# EAGLE design payloads (EAGLE 8.7.1)
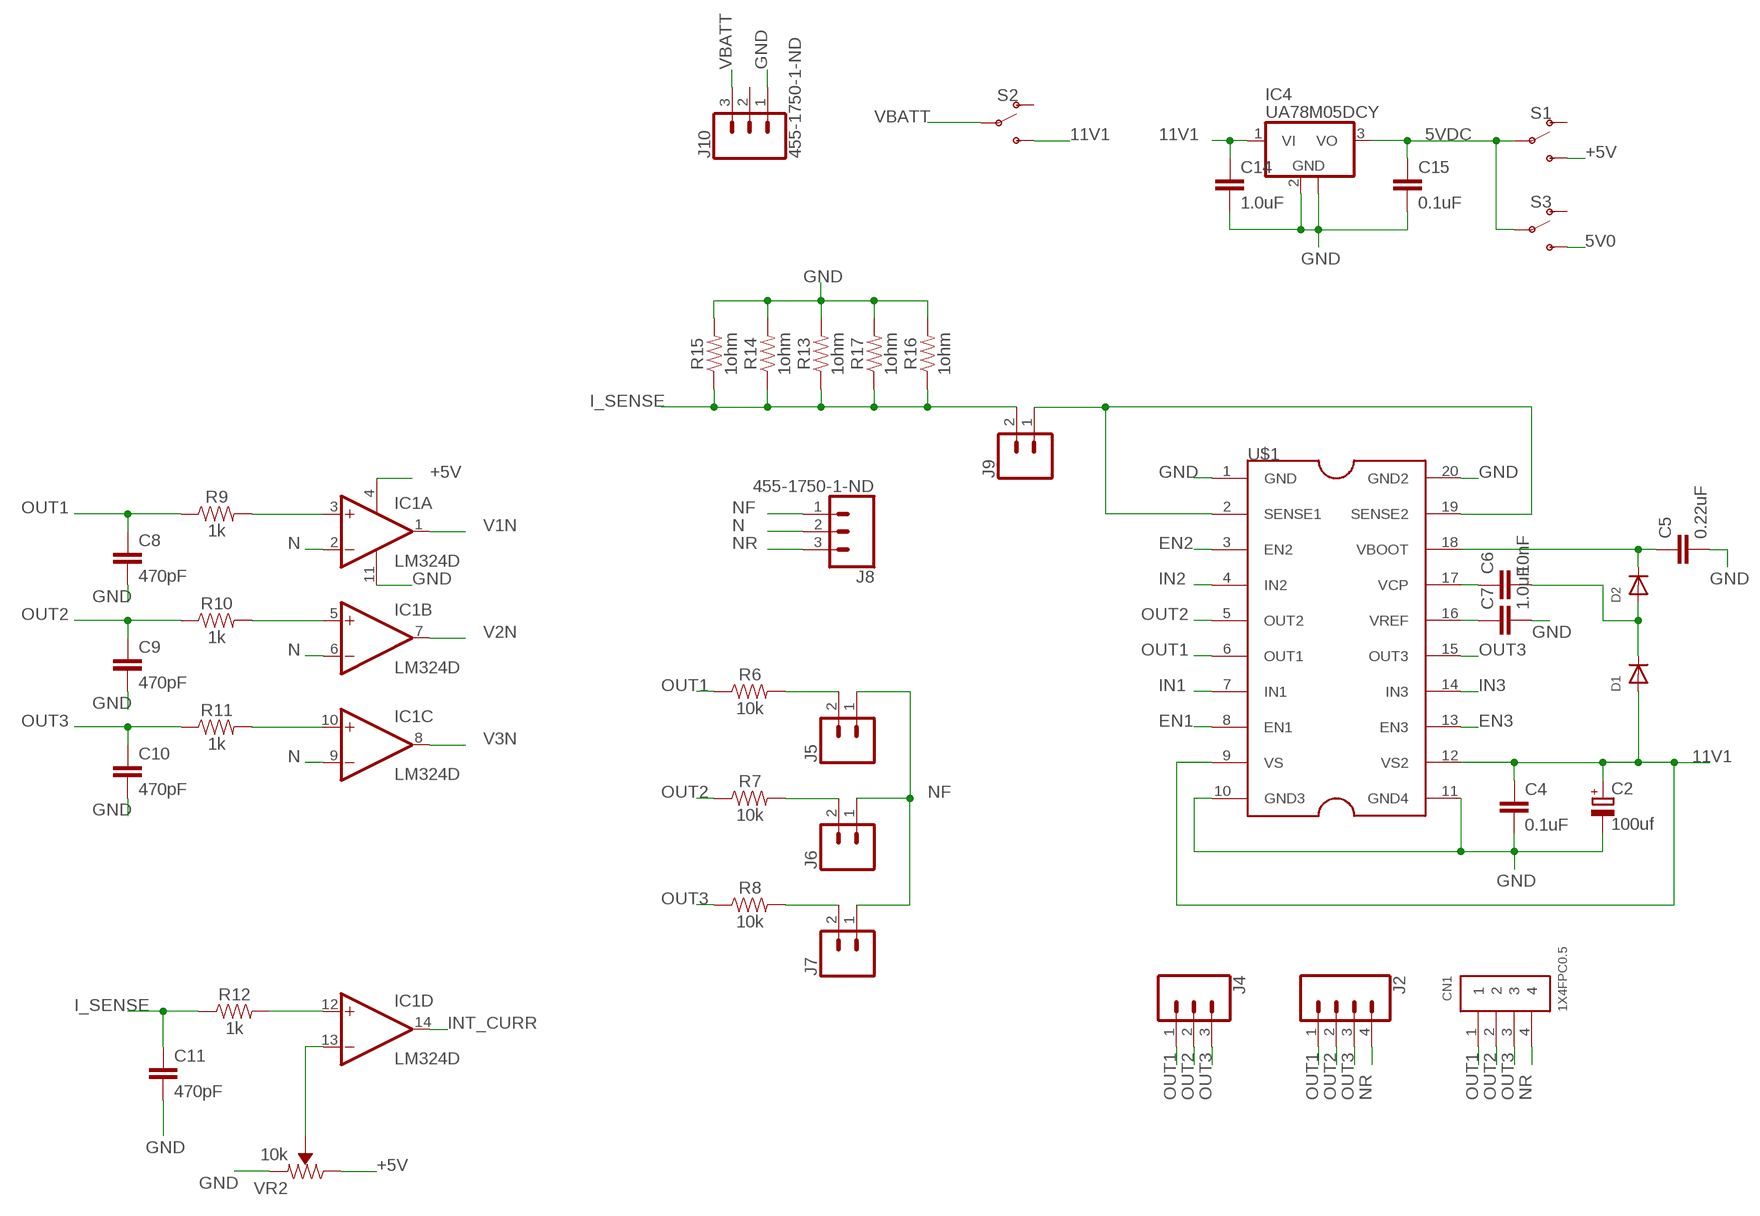
[diagram p0: schematic, sheet 1, part 1 of 2]
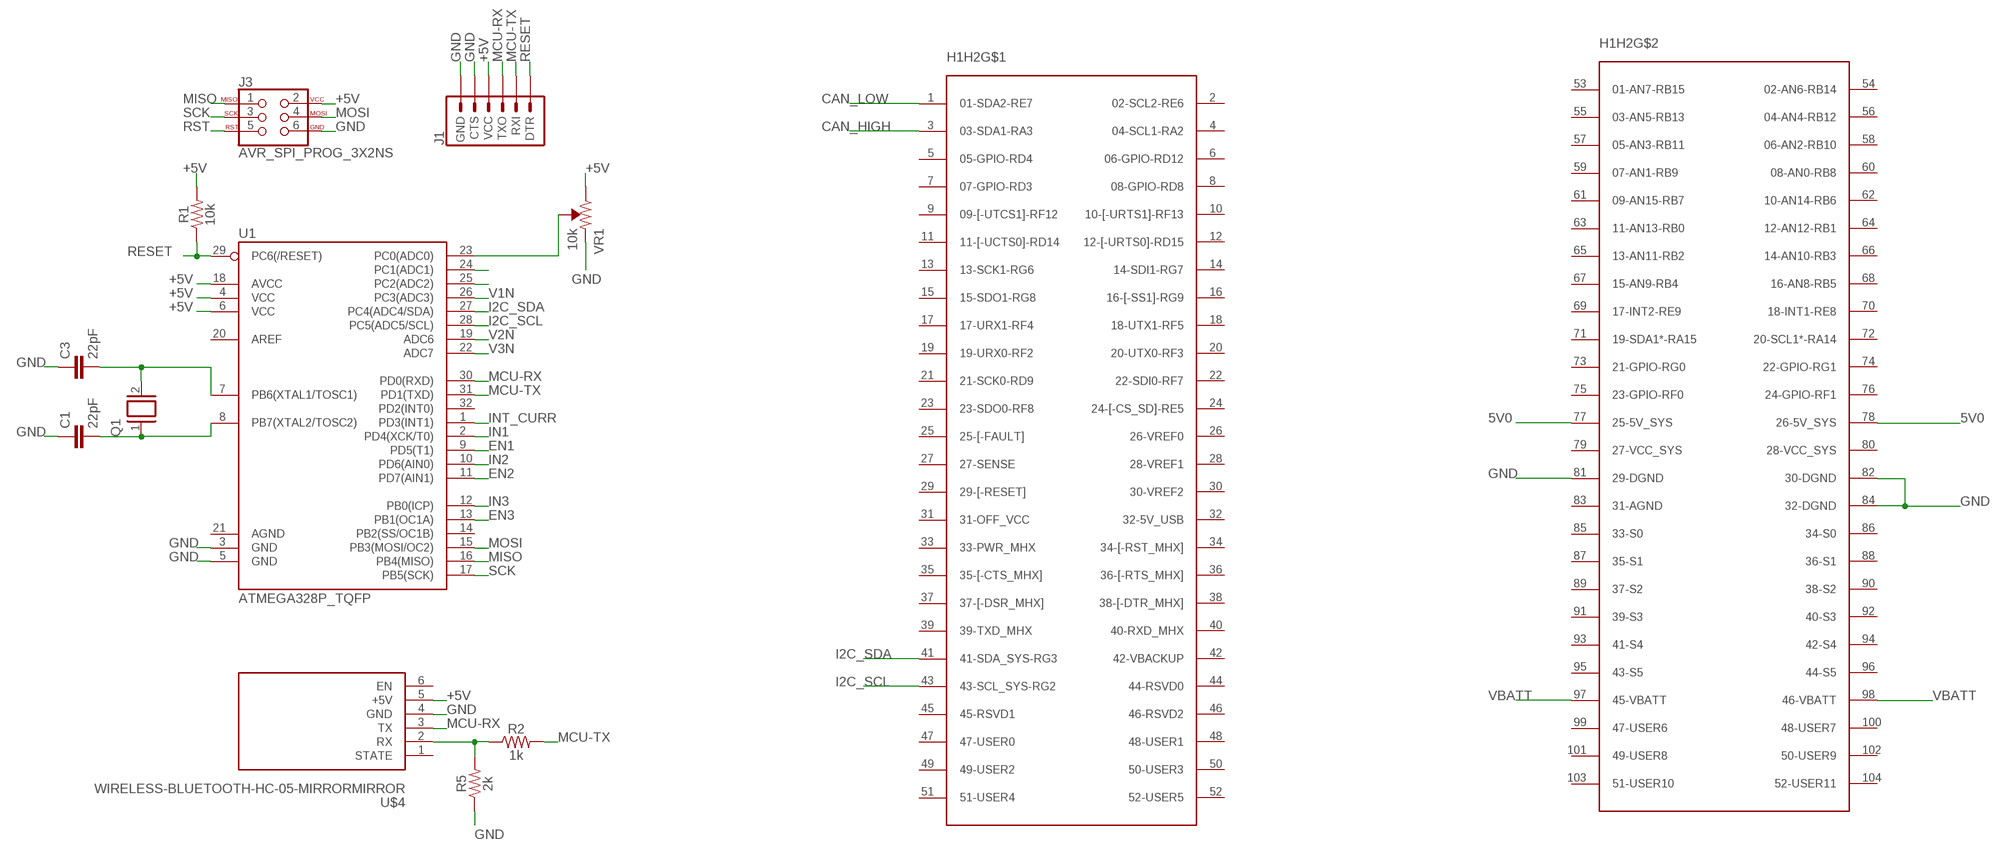
[diagram p1: schematic, sheet 1, part 2 of 2]

## Parts
C1  22pF  2.2UF-1206-50V-10%  [1206]
C2  100uf  CPOL-EUC/6032-28R  [C/6032-28R]
C3  22pF  2.2UF-1206-50V-10%  [1206]
C4  0.1uF  0.1UF-0603-100V-10%  [0603]
C5  0.22uF  0.22UF-0603-25V-10%  [0603]
C6  10nF  10NF-0603-50V-10%  [0603]
C7  1.0uF  1.0UF-0603-16V-10%  [0603]
C8  470pF  470PF-0603-50V-5%  [0603]
C9  470pF  470PF-0603-50V-5%  [0603]
C10  470pF  470PF-0603-50V-5%  [0603]
C11  470pF  470PF-0603-50V-5%  [0603]
C14  1.0uF  1.0UF-1206-50V-10%  [1206]
C15  0.1uF  1.0UF-1206-50V-10%  [1206]
CN1  1X4FPC0.5  [FPC_0.5MM-4]
D1  DIODESOD-123  [SOD-123]
D2  DIODESOD-123  [SOD-123]
H1H2  PC104_CONN  [PC_104]
IC1  LM324D  [SO14]
IC4  UA78M05DCY  [SOT223]
J1  6_PIN_SERIAL_TARGET  [1X06]
J2  CONN_04  [1X04]
J3  AVR_SPI_PROG_3X2NS  [2X3-NS]
J4  CONN_03-SCREW-5MM  [SCREWTERMINAL-5MM-3]
J5  CONN_02  [1X02]
J6  CONN_02  [1X02]
J7  CONN_02  [1X02]
J8  455-1750-1-ND  CONN_03  [1X03]
J9  CONN_02  [1X02]
J10  455-1750-1-ND  CONN_03  [1X03]
Q1  XTAL/S  [QS]
R1  10k  RESISTOR1206  [1206]
R2  1k  1KOHM-HORIZ-1/4W-5%  [AXIAL-0.3]
R5  2k  RESISTORAXIAL-0.3  [AXIAL-0.3]
R6  10k  10KOHM-HORIZ-1/4W-1%  [AXIAL-0.3]
R7  10k  10KOHM-HORIZ-1/4W-1%  [AXIAL-0.3]
R8  10k  10KOHM-HORIZ-1/4W-1%  [AXIAL-0.3]
R9  1k  1KOHM-0603-1/10W-1%  [0603]
R10  1k  1KOHM-0603-1/10W-1%  [0603]
R11  1k  1KOHM-0603-1/10W-1%  [0603]
R12  1k  1KOHM-0603-1/10W-1%  [0603]
R13  1ohm  1KOHM-HORIZ-1/4W-1%  [AXIAL-0.3]
R14  1ohm  1KOHM-HORIZ-1/4W-1%  [AXIAL-0.3]
R15  1ohm  1KOHM-HORIZ-1/4W-1%  [AXIAL-0.3]
R16  1ohm  1KOHM-HORIZ-1/4W-1%  [AXIAL-0.3]
R17  1ohm  1KOHM-HORIZ-1/4W-1%  [AXIAL-0.3]
S1  SWITCH-SPDT-PTH-11.6X4.0MM  [SWITCH_SPDT_PTH_11.6X4.0MM]
S2  SWITCH-SPDT-PTH-11.6X4.0MM  [SWITCH_SPDT_PTH_11.6X4.0MM]
S3  SWITCH-SPDT-PTH-11.6X4.0MM  [SWITCH_SPDT_PTH_11.6X4.0MM]
U1  ATMEGA328P_TQFP  [TQFP32-08]
U$1  L6234PD  [SO20]
U$4  WIRELESS-BLUETOOTH-HC-05-MIRRORMIRROR  [WIRELESS-BLUETOOTH-HC-05-MIRROR]
VR1  10k  TRIMPOT-PTH-10MM-KNOB-1/2W-10%  [TRIMPOT-PTH-3386U]
VR2  10k  TRIMPOT-PTH-10MM-KNOB-1/2W-10%  [TRIMPOT-PTH-3386U]

## Nets
5V0: H1H2.77(25-5V_SYS) H1H2.78(26-5V_SYS) S3.3(S)
5VDC: C15.1 IC4.3(VO) S1.2(P) S3.2(P)
11V1: C2.+ C4.1 C14.1 D1.A IC4.1(VI) S2.3(S) U$1.9(VS) U$1.12(VS2)
+5V: IC1.4(P:V+) J1.4(VCC) J3.2 R1.2 S1.3(S) U1.4(VCC) U1.6(VCC) U1.18(AVCC) U$4.5(+5V) VR1.3(CW) VR2.3(CW)
CAN_HIGH: H1H2.3(03-SDA1-RA3)
CAN_LOW: H1H2.1(01-SDA2-RE7)
EN1: U1.9(PD5(T1)) U$1.8(EN1)
EN2: U1.11(PD7(AIN1)) U$1.3(EN2)
EN3: U1.13(PB1(OC1A)) U$1.13(EN3)
GND: C1.1 C2.- C3.1 C4.2 C5.2 C7.2 C8.2 C9.2 C10.2 C11.2 C14.2 C15.2 H1H2.81(29-DGND) H1H2.82(30-DGND) H1H2.84(32-DGND) IC1.11(P:V-) IC4.2(GND) IC4.4(GND) J1.5(CTS) J1.6(GND) J3.6 J10.1 R5.P$1 R13.P$2 R14.P$2 R15.P$2 R16.P$2 R17.P$2 U1.3(GND) U1.5(GND) U$1.1(GND) U$1.10(GND3) U$1.11(GND4) U$1.20(GND2) U$4.4(GND) VR1.1(CCW) VR2.1(CCW)
I2C_SCL: H1H2.43(43-SCL_SYS-RG2) U1.28(PC5(ADC5/SCL))
I2C_SDA: H1H2.41(41-SDA_SYS-RG3) U1.27(PC4(ADC4/SDA))
I_SENSE: C11.1 J9.2 R12.1 R13.P$1 R14.P$1 R15.P$1 R16.P$1 R17.P$1
IN1: U1.2(PD4(XCK/T0)) U$1.7(IN1)
IN2: U1.10(PD6(AIN0)) U$1.4(IN2)
IN3: U1.12(PB0(ICP)) U$1.14(IN3)
INT_CURR: IC1.14(D:OUT) U1.1(PD3(INT1))
MCU-RX: J1.3(TXO) U1.30(PD0(RXD)) U$4.3(TX)
MCU-TX: J1.2(RXI) R2.P$2 U1.31(PD1(TXD))
MISO: J3.1 U1.16(PB4(MISO))
MOSI: J3.4 U1.15(PB3(MOSI/OC2))
N: IC1.2(A:-IN) IC1.6(B:-IN) IC1.9(C:-IN) J8.2
N$1: C3.2 Q1.2 U1.7(PB6(XTAL1/TOSC1))
N$2: C1.2 Q1.1 U1.8(PB7(XTAL2/TOSC2))
N$3: R2.P$1 R5.P$2 U$4.2(RX)
N$5: C6.1 U$1.17(VCP)
N$6: C6.2 D1.C D2.A
N$7: C5.1 D2.C U$1.18(VBOOT)
N$8: IC1.13(D:-IN) VR2.2(WIPER)
N$9: U1.23(PC0(ADC0)) VR1.2(WIPER)
N$10: C7.1 U$1.16(VREF)
N$11: IC1.3(A:+IN) R9.2
N$12: J5.2 R6.P$2
N$13: J6.2 R7.P$2
N$14: J7.2 R8.P$2
N$15: IC1.5(B:+IN) R10.2
N$16: IC1.10(C:+IN) R11.2
N$17: IC1.12(D:+IN) R12.2
N$18: U1.25(PC2(ADC2))
N$19: U1.24(PC1(ADC1))
N$21: J9.1 U$1.2(SENSE1) U$1.19(SENSE2)
NF: J5.1 J6.1 J7.1 J8.1
NR: CN1.4 J2.4 J8.3
OUT1: C8.1 CN1.1 J2.1 J4.1 R6.P$1 R9.1 U$1.6(OUT1)
OUT2: C9.1 CN1.2 J2.2 J4.2 R7.P$1 R10.1 U$1.5(OUT2)
OUT3: C10.1 CN1.3 J2.3 J4.3 R8.P$1 R11.1 U$1.15(OUT3)
RESET: J1.1(DTR) R1.1 U1.29(PC6(/RESET))
RST: J3.5
SCK: J3.3 U1.17(PB5(SCK))
V1N: IC1.1(A:OUT) U1.26(PC3(ADC3))
V2N: IC1.7(B:OUT) U1.19(ADC6)
V3N: IC1.8(C:OUT) U1.22(ADC7)
VBATT: H1H2.97(45-VBATT) H1H2.98(46-VBATT) J10.3 S2.2(P)
Unconnected: H1H2.2(02-SCL2-RE6) H1H2.4(04-SCL1-RA2) H1H2.5(05-GPIO-RD4) H1H2.6(06-GPIO-RD12) H1H2.7(07-GPIO-RD3) H1H2.8(08-GPIO-RD8) H1H2.9(09-[-UTCS1]-RF12) H1H2.10(10-[-URTS1]-RF13) H1H2.11(11-[-UCTS0]-RD14) H1H2.12(12-[-URTS0]-RD15) H1H2.13(13-SCK1-RG6) H1H2.14(14-SDI1-RG7) H1H2.15(15-SDO1-RG8) H1H2.16(16-[-SS1]-RG9) H1H2.17(17-URX1-RF4) H1H2.18(18-UTX1-RF5) H1H2.19(19-URX0-RF2) H1H2.20(20-UTX0-RF3) H1H2.21(21-SCK0-RD9) H1H2.22(22-SDI0-RF7) H1H2.23(23-SDO0-RF8) H1H2.24(24-[-CS_SD]-RE5) H1H2.25(25-[-FAULT]) H1H2.26(26-VREF0) H1H2.27(27-SENSE) H1H2.28(28-VREF1) H1H2.29(29-[-RESET]) H1H2.30(30-VREF2) H1H2.31(31-OFF_VCC) H1H2.32(32-5V_USB) H1H2.33(33-PWR_MHX) H1H2.34(34-[-RST_MHX]) H1H2.35(35-[-CTS_MHX]) H1H2.36(36-[-RTS_MHX]) H1H2.37(37-[-DSR_MHX]) H1H2.38(38-[-DTR_MHX]) H1H2.39(39-TXD_MHX) H1H2.40(40-RXD_MHX) H1H2.42(42-VBACKUP) H1H2.44(44-RSVD0) H1H2.45(45-RSVD1) H1H2.46(46-RSVD2) H1H2.47(47-USER0) H1H2.48(48-USER1) H1H2.49(49-USER2) H1H2.50(50-USER3) H1H2.51(51-USER4) H1H2.52(52-USER5) H1H2.53(01-AN7-RB15) H1H2.54(02-AN6-RB14) H1H2.55(03-AN5-RB13) H1H2.56(04-AN4-RB12) H1H2.57(05-AN3-RB11) H1H2.58(06-AN2-RB10) H1H2.59(07-AN1-RB9) H1H2.60(08-AN0-RB8) H1H2.61(09-AN15-RB7) H1H2.62(10-AN14-RB6) H1H2.63(11-AN13-RB0) H1H2.64(12-AN12-RB1) H1H2.65(13-AN11-RB2) H1H2.66(14-AN10-RB3) H1H2.67(15-AN9-RB4) H1H2.68(16-AN8-RB5) H1H2.69(17-INT2-RE9) H1H2.70(18-INT1-RE8) H1H2.71(19-SDA1*-RA15) H1H2.72(20-SCL1*-RA14) H1H2.73(21-GPIO-RG0) H1H2.74(22-GPIO-RG1) H1H2.75(23-GPIO-RF0) H1H2.76(24-GPIO-RF1) H1H2.79(27-VCC_SYS) H1H2.80(28-VCC_SYS) H1H2.83(31-AGND) H1H2.85(33-S0) H1H2.86(34-S0) H1H2.87(35-S1) H1H2.88(36-S1) H1H2.89(37-S2) H1H2.90(38-S2) H1H2.91(39-S3) H1H2.92(40-S3) H1H2.93(41-S4) H1H2.94(42-S4) H1H2.95(43-S5) H1H2.96(44-S5) H1H2.99(47-USER6) H1H2.100(48-USER7) H1H2.101(49-USER8) H1H2.102(50-USER9) H1H2.103(51-USER10) H1H2.104(52-USER11) J10.2 S1.1(O) S2.1(O) S3.1(O) U1.14(PB2(SS/OC1B)) U1.20(AREF) U1.21(AGND) U1.32(PD2(INT0)) U$4.1(STATE) U$4.6(EN)

## Library data of the parts
C1 C3 = SparkFun-Capacitors:2.2UF: 2.2µF ceramic capacitors A capacitor is a passive two-terminal electrical component used to store electrical energy temporarily in an electric field.; PROD_ID: CAP-10009; VALUE: 2.2uF
C2 = rcl:CPOL-EU: POLARIZED CAPACITOR, European symbol; SPICEPREFIX: C
C4 = SparkFun-Capacitors:0.1UF: 0.1µF ceramic capacitors A capacitor is a passive two-terminal electrical component used to store electrical energy temporarily in an electric field.; PROD_ID: CAP-08390
C5 = SparkFun-Capacitors:0.22UF: 0.22µF ceramic capacitors A capacitor is a passive two-terminal electrical component used to store electrical energy temporarily in an electric field.; PROD_ID: CAP-07822
C6 = SparkFun-Capacitors:10NF: 0.01uF/10nF/10,000pF ceramic capacitors A capacitor is a passive two-terminal electrical component used to store electrical energy temporarily in an electric field. CAP-09321; PROD_ID: CAP-00867
C7 = SparkFun-Capacitors:1.0UF: 1µF ceramic capacitors A capacitor is a passive two-terminal electrical component used to store electrical energy temporarily in an electric field.; PROD_ID: CAP-00868
C8-C11 = SparkFun-Capacitors:470PF: 470pF ceramic capacitors A capacitor is a passive two-terminal electrical component used to store electrical energy temporarily in an electric field.; PROD_ID: CAP-07884
C14 = SparkFun-Capacitors:1.0UF: 1µF ceramic capacitors A capacitor is a passive two-terminal electrical component used to store electrical energy temporarily in an electric field.; PROD_ID: CAP-09822
C15 = SparkFun-Capacitors:1.0UF: 1µF ceramic capacitors A capacitor is a passive two-terminal electrical component used to store electrical energy temporarily in an electric field.; PROD_ID: CAP-09822; VALUE: 1.0uF
CN1 = adafruit:1X4: 4-pin connector
D1 D2 = adafruit:DIODE: Diode SMADIODE - SMA Surface Mount Package 20V 1A Schottky Diode Digikey: 641-1014-6-ND DO-1N4148 - Through Hole Small Current Diode SOD-123 20V 1 A (.5mV Vf) Schottky Diode - Digikey: MBRX120TPMSCT-ND SOD-323 10V 570mA (.38mV Vf, 3ns) Schottky Diode - Digikey: ZLLS410CT-ND SOD-523 30V 30mA Schottky Diode (RB751S-40TE61) - Digikey: RB751S-40TE61CT-ND SOT23-R/W - SOT23 Package (R = Solder Paste/Reflow Ovens, W = Hand-Soldering) BAT54Film 40V 300mA - Digikey: 497-7162-1-ND
H1H2 = SUCHAI:PC104_CONN
IC1 = linear:LM324: OP AMP
IC4 = linear:UA78M*: POSITIVE-VOLTAGE REGULATORS Source: http://focus.ti.com/lit/ds/symlink/ua78m33.pdf
J1 = SparkFun-Connectors:6_PIN_SERIAL_TARGET: 6-pin header connection for use with the "FTDI BASIC" pinout - TARGET SIDE. Also known as "Arduino Serial Program Header". It is used to mate with our FTDI Basic serial programmers using the Arduino IDE. Note, this device has "TARGET" in the name. It is intended to be used on a design that contains a target micro-controller that you wish to program. The "sister" device, named "CABLE" is inteneded to be used on a design that usually lives on the end of your USB cable and prvides the converter chip (FTDI232 or FTDI231x) to commnicate serial RX/TX. You can populate with some of these: Break Away Headers - Straight <https://www.sparkfun.com/products/116> (PRT-00116) For reference (or to suit your programming needs) check out these designs: SparkFun FTDI Basic Breakout - 5V <https://www.sparkfun.com/products/9716> (DEV-09716) SparkFun FTDI Basic Breakout - 3.3V <https://www.sparkfun.com/products/9873> (DEV-09873) SparkFun FTDI SmartBasic <https://www.sparkfun.com/products/12935> (DEV-12935) SparkFun Beefy 3 - FTDI Basic Breakout <https://www.sparkfun.com/products/13746> (DEV-13746)
J2 = SparkFun-Connectors:CONN_04: Multi connection point. Often used as Generic Header-pin footprint for 0.1 inch spaced/style header connections On any of the 0.1 inch spaced packages, you can populate with these: Break Away Headers - Straight <https://www.sparkfun.com/products/116> (PRT-00116) Break Away Male Headers - Right Angle <https://www.sparkfun.com/products/553> (PRT-00553) Female Headers <https://www.sparkfun.com/products/115> (PRT-00115) Break Away Headers - Machine Pin <https://www.sparkfun.com/products/117> (PRT-00117) Break Away Female Headers - Swiss Machine Pin <https://www.sparkfun.com/products/743> (PRT-00743) For SCREWTERMINALS and SPRING TERMINALS visit here: Screw Terimnals on SparkFun.com <https://www.sparkfun.com/search/results?term=Screw+Terminals> (5mm/3.5mm/2.54mm spacing) This device is also useful as a general connection point to wire up your design to another part of your project. Our various solder wires solder well into these plated through hole pads. Hook-Up Wire - Assortment (Stranded, 22 AWG) <https://www.sparkfun.com/products/11375> (PRT-11375) Hook-Up Wire - Assortment (Solid Core, 22 AWG) <https://www.sparkfun.com/products/11367> (PRT-11367) View the entire wire category on our website here <https://www.sparkfun.com/categories/141> Special notes: Molex polarized connector foot print use with SKU : PRT-08231 with associated crimp pins and housings. 1MM SMD Version SKU: PRT-10208; PROD_ID: CONN-09696
J3 = SparkFun-Connectors:AVR_SPI_PROG_3X2: AVR ISP 6 Pin This is the reduced ISP connector for AVR programming. Common on Arduino. This footprint will take up less PCB space and can be used with a 10-pin to 6-pin adapter such as SKU: BOB-08508 **Special note about "TEST_POINT" package. The stop mask is on the top side, so if you want your programming test points to be on the bottom of your board, make sure to place this package on the bottom side of the board. This also ensure that the orientation to program from the bottom side will be correct. SparkFun Products: SparkFun ISP Pogo Adapter <https://www.sparkfun.com/products/11591> - NS Tiny AVR Programmer <https://www.sparkfun.com/products/11801> -PTH
J4 = SparkFun-Connectors:CONN_03: Multi connection point. Often used as Generic Header-pin footprint for 0.1 inch spaced/style header connections On any of the 0.1 inch spaced packages, you can populate with these: Break Away Headers - Straight <https://www.sparkfun.com/products/116> (PRT-00116) Break Away Male Headers - Right Angle <https://www.sparkfun.com/products/553> (PRT-00553) Female Headers <https://www.sparkfun.com/products/115> (PRT-00115) Break Away Headers - Machine Pin <https://www.sparkfun.com/products/117> (PRT-00117) Break Away Female Headers - Swiss Machine Pin <https://www.sparkfun.com/products/743> (PRT-00743) Stackable Header - 3 Pin (Female, 0.1") <https://www.sparkfun.com/products/13875> (PRT-13875) For SCREWTERMINALS and SPRING TERMINALS visit here: Screw Terimnals on SparkFun.com <https://www.sparkfun.com/search/results?term=Screw+Terminals> (5mm/3.5mm/2.54mm spacing) This device is also useful as a general connection point to wire up your design to another part of your project. Our various solder wires solder well into these plated through hole pads. Hook-Up Wire - Assortment (Stranded, 22 AWG) <https://www.sparkfun.com/products/11375> (PRT-11375) Hook-Up Wire - Assortment (Solid Core, 22 AWG) <https://www.sparkfun.com/products/11367> (PRT-11367) View the entire wire category on our website here <https://www.sparkfun.com/categories/141> Special notes: Molex polarized connector foot print use with SKU : PRT-08232 with associated crimp pins and housings.; PROD_ID: CONN-10134; SF_SKU: PRT-08433
J5-J7 J9 = SparkFun-Connectors:CONN_02: Multi connection point. Often used as Generic Header-pin footprint for 0.1 inch spaced/style header connections On any of the 0.1 inch spaced packages, you can populate with these: Break Away Headers - Straight <https://www.sparkfun.com/products/116> (PRT-00116) Break Away Male Headers - Right Angle <https://www.sparkfun.com/products/553> (PRT-00553) Female Headers <https://www.sparkfun.com/products/115> (PRT-00115) Break Away Headers - Machine Pin <https://www.sparkfun.com/products/117> (PRT-00117) Break Away Female Headers - Swiss Machine Pin <https://www.sparkfun.com/products/743> (PRT-00743) For SCREWTERMINALS and SPRING TERMINALS visit here: Screw Terimnals on SparkFun.com <https://www.sparkfun.com/search/results?term=Screw+Terminals> (5mm/3.5mm/2.54mm spacing) This device is also useful as a general connection point to wire up your design to another part of your project. Our various solder wires solder well into these plated through hole pads. Hook-Up Wire - Assortment (Stranded, 22 AWG) <https://www.sparkfun.com/products/11375> (PRT-11375) Hook-Up Wire - Assortment (Solid Core, 22 AWG) <https://www.sparkfun.com/products/11367> (PRT-11367) View the entire wire category on our website here <https://www.sparkfun.com/categories/141> Special notes: Molex polarized connector foot print use with: PRT-08233 with associated crimp pins and housings. 2.54_SCREWTERM for use with PRT-10571. 3.5mm Screw Terminal footprints for PRT-08084 5mm Screw Terminal footprints for use with PRT-08432
J8 J10 = SparkFun-Connectors:CONN_03: Multi connection point. Often used as Generic Header-pin footprint for 0.1 inch spaced/style header connections On any of the 0.1 inch spaced packages, you can populate with these: Break Away Headers - Straight <https://www.sparkfun.com/products/116> (PRT-00116) Break Away Male Headers - Right Angle <https://www.sparkfun.com/products/553> (PRT-00553) Female Headers <https://www.sparkfun.com/products/115> (PRT-00115) Break Away Headers - Machine Pin <https://www.sparkfun.com/products/117> (PRT-00117) Break Away Female Headers - Swiss Machine Pin <https://www.sparkfun.com/products/743> (PRT-00743) Stackable Header - 3 Pin (Female, 0.1") <https://www.sparkfun.com/products/13875> (PRT-13875) For SCREWTERMINALS and SPRING TERMINALS visit here: Screw Terimnals on SparkFun.com <https://www.sparkfun.com/search/results?term=Screw+Terminals> (5mm/3.5mm/2.54mm spacing) This device is also useful as a general connection point to wire up your design to another part of your project. Our various solder wires solder well into these plated through hole pads. Hook-Up Wire - Assortment (Stranded, 22 AWG) <https://www.sparkfun.com/products/11375> (PRT-11375) Hook-Up Wire - Assortment (Solid Core, 22 AWG) <https://www.sparkfun.com/products/11367> (PRT-11367) View the entire wire category on our website here <https://www.sparkfun.com/categories/141> Special notes: Molex polarized connector foot print use with SKU : PRT-08232 with associated crimp pins and housings.; PROD_ID: XXX-00000
Q1 = special:XTAL/S: CRYSTAL
R1 = SparkFun-Resistors:RESISTOR: Generic Resistor Package
R2 = resistors-longpads:1KOHM: 1kΩ resistor A resistor is a passive two-terminal electrical component that implements electrical resistance as a circuit element. Resistors act to reduce current flow, and, at the same time, act to lower voltage levels within circuits. - Wikipedia; PROD_ID: RES-08380
R5 = resistors-longpads:RESISTOR: Generic Resistor Package
R6-R8 = SparkFun-Resistors:10KOHM: 10kΩ resistor A resistor is a passive two-terminal electrical component that implements electrical resistance as a circuit element. Resistors act to reduce current flow, and, at the same time, act to lower voltage levels within circuits. - Wikipedia; PROD_ID: RES-12183
R9-R12 = SparkFun-Resistors:1KOHM: 1kΩ resistor A resistor is a passive two-terminal electrical component that implements electrical resistance as a circuit element. Resistors act to reduce current flow, and, at the same time, act to lower voltage levels within circuits. - Wikipedia; PROD_ID: RES-07856
R13-R17 = SparkFun-Resistors:1KOHM: 1kΩ resistor A resistor is a passive two-terminal electrical component that implements electrical resistance as a circuit element. Resistors act to reduce current flow, and, at the same time, act to lower voltage levels within circuits. - Wikipedia; PROD_ID: RES-12182; VALUE: 1k
S1-S3 = SparkFun-Switches:SWITCH-SPDT: Single Pole, Double Throw (SPDT) Switch Single-pole, double-throw (SPDT) switch. Variant Overview SMD-AYZ0202 Surface Mount DPDT Switch <https://www.sparkfun.com/products/597> (COM-00597) Used on e.g. LilyPad Arduino USB - ATmega32U4 Board <https://www.sparkfun.com/products/12049> PTH-11.6X4.0MM SPDT Mini Power Switch <https://www.sparkfun.com/products/102> (COM-00102) Used on e.g. SparkFun Simon Says - Through-Hole Soldering Kit <https://www.sparkfun.com/products/10547> (KIT-10547) PTH-11.6X4.0MM-KIT KIT version of SPDT Mini Power Switch - Simplifies soldering by removing tStop of switch pins - only one side can be soldered. PTH-11.6X4.0MM-LOCK LOCK version of SPDT Mini Power Switch - Offset pins hold switch in place for easier soldering. SMD-RIGHT-ANGLE Surface Mount Right Angle Switch <https://www.sparkfun.com/products/10860> (COM-10860) Used on e.g. SparkFun ESP8266 Thing <https://www.sparkfun.com/products/13231>; PROD_ID: SWCH-08261; SF_SKU: COM-00102
U1 = SparkFun-IC-Microcontroller:ATMEGA328P_TQFP: Popular 328P in QFP Storefront component: ATmega328 - TQFP <https://www.sparkfun.com/products/13448> (COM-13448) Datasheet <http://www.sparkfun.com/datasheets/Components/SMD/ATMega328.pdf> SparkFun Products SparkFun RedBoard - Programmed with Arduino <https://www.sparkfun.com/products/12757> (DEV-12757) Arduino Pro Mini 328 - 5V/16MHz <https://www.sparkfun.com/products/11113> (DEV-11113) Arduino Pro Mini 328 - 3.3V/8MHz <https://www.sparkfun.com/products/11114> (DEV-11114) SparkFun OpenLog <https://www.sparkfun.com/products/13712> (DEV-13712) SparkFun MicroView - OLED Arduino Module <https://www.sparkfun.com/products/12923> (DEV-12923) SparkFun Digital Sandbox <https://www.sparkfun.com/products/12651> (DEV-12651) SparkFun PicoBoard <https://www.sparkfun.com/products/11888> (WIG-11888) Arduino Fio <https://www.sparkfun.com/products/10116> (DEV-10116) LilyPad Arduino 328 Main Board <https://www.sparkfun.com/products/13342> (DEV-13342) SparkFun RedStick <https://www.sparkfun.com/products/13741> (DEV-13741) LilyPad MP3 <https://www.sparkfun.com/products/11013> (DEV-11013) LilyPad Arduino SimpleSnap <https://www.sparkfun.com/products/10941> (DEV-10941) SparkFun Stepoko <https://www.sparkfun.com/products/13899> (ROB-13899) SparkFun Geiger Counter <https://www.sparkfun.com/products/11345> (SEN-11345) SparkFun EL Sequencer <https://www.sparkfun.com/products/12781> (COM-12781) Arduino Pro 328 - 5V/16MHz <https://www.sparkfun.com/products/10915> (DEV-10915) CryptoCape <https://www.sparkfun.com/products/12773> (DEV-12773) SparkFun IR Thermometer Evaluation Board - MLX90614 <https://www.sparkfun.com/products/10740> (SEN-10740) SparkFun RedBot Mainboard <https://www.sparkfun.com/products/12097> (ROB-12097) Arduino Pro 328 - 3.3V/8MHz <https://www.sparkfun.com/products/10914> (DEV-10914) SparkFun Block for Intel® Edison - Arduino <https://www.sparkfun.com/products/13036> (DEV-13036) SparkFun Simon Says - Surface Mount Soldering Kit <https://www.sparkfun.com/products/10935> (KIT-10935) SparkFun 7-Segment Serial Display - Red <https://www.sparkfun.com/products/11441> (COM-11441) SparkFun 7-Segment Serial Display - White <https://www.sparkfun.com/products/11629> (COM-11629) SparkFun 7-Segment Serial Display - Yellow <https://www.sparkfun.com/products/11443> (COM-11443) SparkFun 7-Segment Serial Display - Kelly Green <https://www.sparkfun.com/products/11440> (COM-11440) SparkFun 7-Segment Serial Display - Blue <https://www.sparkfun.com/products/11442> (COM-11442) SparkFun OpenSegment Serial Display - 20mm (Blue) <https://www.sparkfun.com/products/11647> (COM-11647) SparkFun OpenSegment Serial Display - 20mm (Green) <https://www.sparkfun.com/products/11646> (COM-11646) SparkFun OpenSegment Serial Display - 20mm (White) <https://www.sparkfun.com/products/11648> (COM-11648) SparkFun OpenSegment Serial Display - 20mm (Red) <https://www.sparkfun.com/products/11644> (COM-11644) SparkFun OpenSegment Serial Display - 20mm (Yellow) <https://www.sparkfun.com/products/11645> (COM-11645) SparkFun OpenSegment Shield <https://www.sparkfun.com/products/13190> (DEV-13190); PROD_ID: IC-09069
U$1 = BLDC_DRIVER:L6234PD: The L6234 is a triple half bridge to drive a brushless DC motor.
U$4 = diy-modules:WIRELESS-BLUETOOTH-HC-05-MIRROR: Bluetooth Transceiver Module based on HC-05 board Tutorial is available here: https://arduino-info.wikispaces.com/BlueTooth-HC05-HC06-Modules-How-To Click here to find device on ebay.com <http://www.ebay.com/sch/hc-05+module+rs232>
VR1 VR2 = SparkFun-Resistors:TRIMPOT: Trimming Potentiometer (Trimpot) Three-terminal potentiometers, with an adjustable wiper and two adjustable resistors. A pot can be used to create a configurable voltage divider, or as a variable resistor. "Trimpots" are a subset of potentiometers, usually intended for "set-and-forget" applications. They're often more delicate than standard potentiometers - rated for fewer turns. Variants PTH-KNOB - PTH Trimpot w/ finger-adjustable knob Trimpot 10K with Knob <https://www.sparkfun.com/products/9806> (COM-09806) Datasheet <http://www.sparkfun.com/datasheets/Components/General/TSR-3386.pdf> SMD-3MM-CLOSED-FRAME - SMD 3mm Square Closed-Frame Trimpot Used on e.g. EasyDriver - Stepper Motor Driver <https://www.sparkfun.com/products/12779> Datasheet <http://www.bitechnologies.com/pdfs/22.pdf> (22AR10KTR) SMD-5MM - SMD 5mm Square Closed-Frame Trimpot Used on e.g. IOIO-OTG - V2.2 <https://www.sparkfun.com/products/13613> Datasheet <http://www.vishay.com/docs/51008/ts53.pdf> (TS53YL502MR10) SMD-3MM-1/10W-25% - 3mm Square Open-Frame Trimpot Used on e.g. SparkFun Shapeoko <https://www.sparkfun.com/products/13899> Datasheet <http://www.bourns.com/docs/Product-Datasheets/TC33.pdf> (TC33X-2-103E); PROD_ID: RES-09730; SF_SKU: COM-09806

## Board
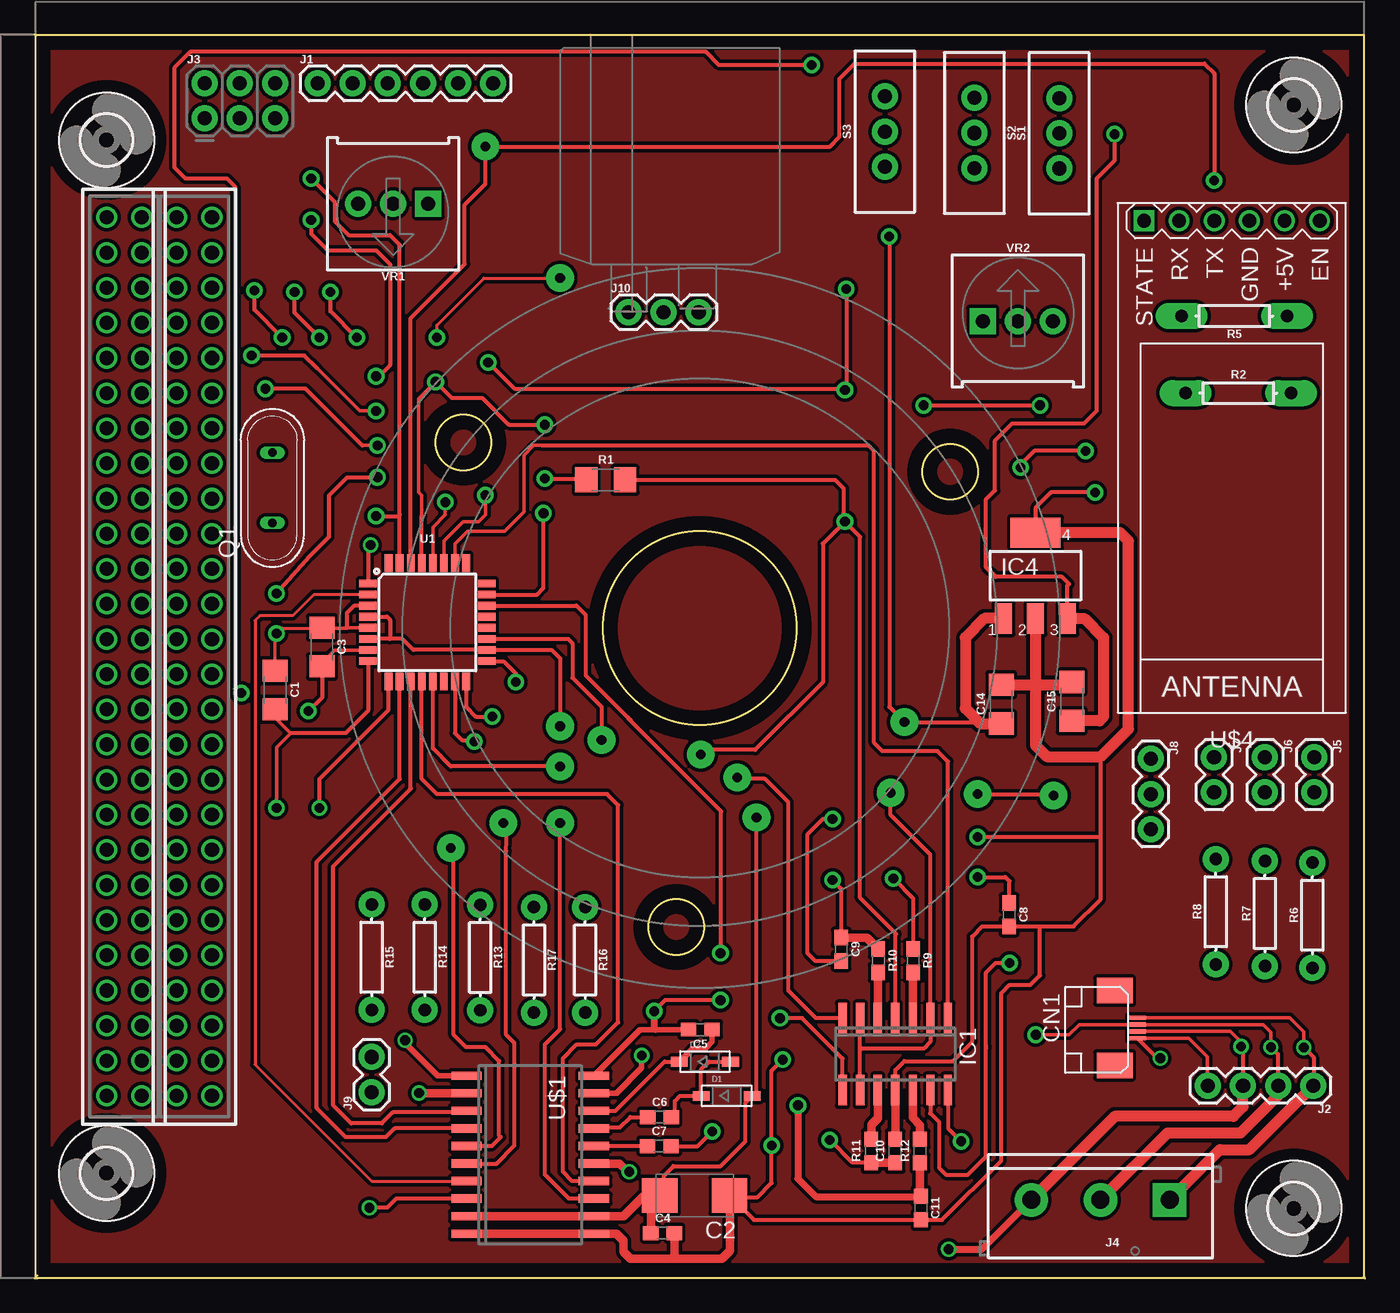
[diagram p2: board, top side]
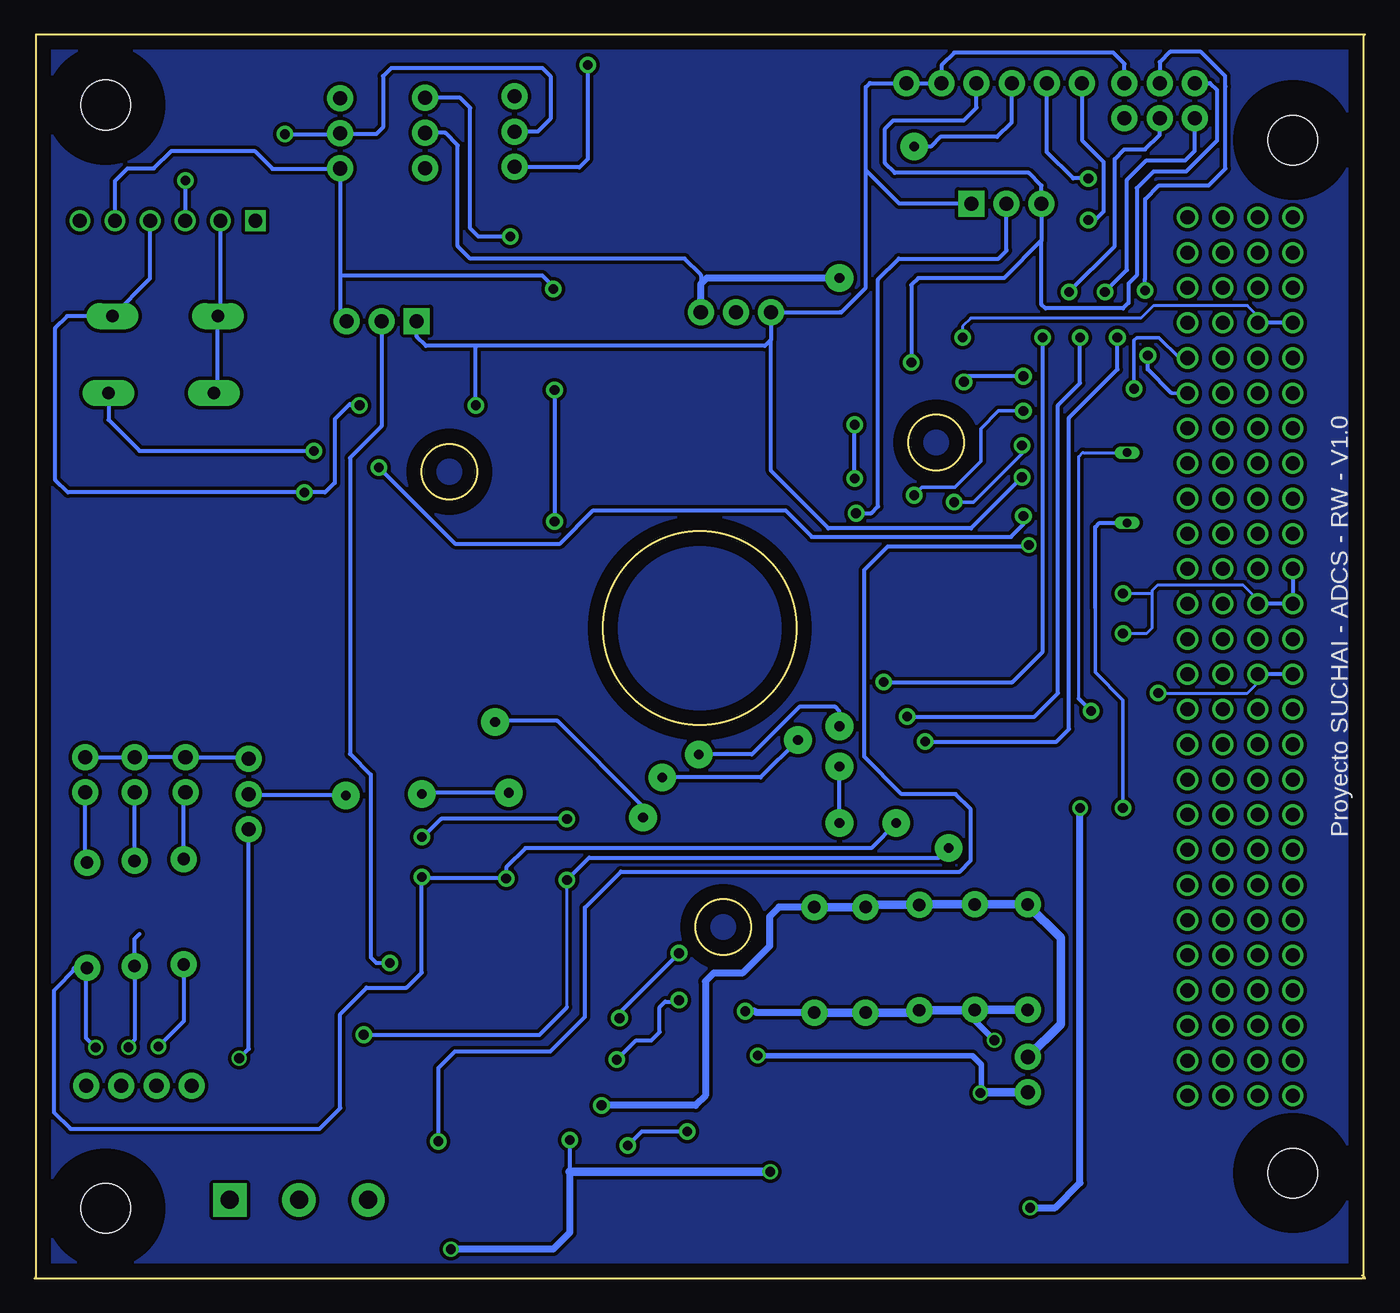
[diagram p3: board, bottom side, seen from below]

Size 96.2 x 89.9 mm. Coordinates in mm from the lower left corner, seen from the top.
Outline: 0.1,89.88 0.1,89.88
Outline: 96.14,0 96.11,0
Outline: 0.1,0 0.1,0.1
Outline: 0.1,0.1 0.1,89.8 0,89.9 96.1,89.9 96.1,0.1 96.2,0 0.2,0 0.1,0.1
Outline: 0.1,0.1 0,0
Outline: 0.1,0.1 0.2,0.2
Outline: circle at 48.1,47 radius 7
Outline: circle at 31,60.4 radius 2
Outline: circle at 66.2,58.3 radius 2
Outline: circle at 46.4,25.4 radius 2
Copper layers (1*16): Top 0.035mm / dielectric 1.5mm / Bottom 0.035mm
Design rules "default *": minimum track width 0.2mm, minimum drill 20mil, track to track 10mil, track to pad 10mil, pad to pad 0.05mm, via to via 10mil, smd to smd 0.05mm, copper to edge 40mil, drill to drill 8mil, minimum pad ring 5mil, minimum via ring 8mil, stop-mask expansion 4mil, vias tented up to drill 0mil, thermal gap 10mil

### Footprints (pad centres in the part's own frame; a part is rotated, then mirrored left to right if it is on the bottom)
1206 = smd 1.6 x 1.8: 1 -1.4,0; 2 1.4,0
C/6032-28R = smd 2.55 x 2.5: + 2.525,0; - -2.525,0
0603 = smd 1.1 x 1: 1 -0.85,0; 2 0.85,0
FPC_0.5MM-4 = smd 0.3 x 1.25: 1 -0.75,-0.45; 2 -0.25,-0.45; 3 0.25,-0.45; 4 0.75,-0.45 | smd 1.85 x 2.6: MT -2.7,-2.1; MT2 2.7,-2.1
SOD-123 = smd 1.2 x 0.7: A 1.85,0; C -1.85,0
PC_104 = drill 1.016 pad 1.524: 1 83.312,76.708; 2 85.852,76.708; 3 83.312,74.168; 4 85.852,74.168; 5 83.312,71.628; 6 85.852,71.628; 7 83.312,69.088; 8 85.852,69.088; 9 83.312,66.548; 10 85.852,66.548; 11 83.312,64.008; 12 85.852,64.008; 13 83.312,61.468; 14 85.852,61.468; 15 83.312,58.928; 16 85.852,58.928; 17 83.312,56.388; 18 85.852,56.388; 19 83.312,53.848; 20 85.852,53.848; 21 83.312,51.308; 22 85.852,51.308; 23 83.312,48.768; 24 85.852,48.768; 25 83.312,46.228; 26 85.852,46.228; 27 83.312,43.688; 28 85.852,43.688; 29 83.312,41.148; 30 85.852,41.148; 31 83.312,38.608; 32 85.852,38.608; 33 83.312,36.068; 34 85.852,36.068; 35 83.312,33.528; 36 85.852,33.528; 37 83.312,30.988; 38 85.852,30.988; 39 83.312,28.448; 40 85.852,28.448; 41 83.312,25.908; 42 85.852,25.908; 43 83.312,23.368; 44 85.852,23.368; 45 83.312,20.828; 46 85.852,20.828; 47 83.312,18.288; 48 85.852,18.288; 49 83.312,15.748; 50 85.852,15.748; 51 83.312,13.208; 52 85.852,13.208; 53 88.392,76.708; 54 90.932,76.708; 55 88.392,74.168; 56 90.932,74.168; 57 88.392,71.628; 58 90.932,71.628; 59 88.392,69.088; 60 90.932,69.088; 61 88.392,66.548; 62 90.932,66.548; 63 88.392,64.008; 64 90.932,64.008; 65 88.392,61.468; 66 90.932,61.468; 67 88.392,58.928; 68 90.932,58.928; 69 88.392,56.388; 70 90.932,56.388; 71 88.392,53.848; 72 90.932,53.848; 73 88.392,51.308; 74 90.932,51.308; 75 88.392,48.768; 76 90.932,48.768; 77 88.392,46.228; 78 90.932,46.228; 79 88.392,43.688; 80 90.932,43.688; 81 88.392,41.148; 82 90.932,41.148; 83 88.392,38.608; 84 90.932,38.608; 85 88.392,36.068; 86 90.932,36.068; 87 88.392,33.528; 88 90.932,33.528; 89 88.392,30.988; 90 90.932,30.988; 91 88.392,28.448; 92 90.932,28.448; 93 88.392,25.908; 94 90.932,25.908; 95 88.392,23.368; 96 90.932,23.368; 97 88.392,20.828; 98 90.932,20.828; 99 88.392,18.288; 100 90.932,18.288; 101 88.392,15.748; 102 90.932,15.748; 103 88.392,13.208; 104 90.932,13.208
SO14 = smd 0.6 x 2.2: 1 -3.81,-2.6; 2 -2.54,-2.6; 3 -1.27,-2.6; 4 0,-2.6; 5 1.27,-2.6; 6 2.54,-2.6; 7 3.81,-2.6; 8 3.81,2.6; 9 2.54,2.6; 10 1.27,2.6; 11 0,2.6; 12 -1.27,2.6; 13 -2.54,2.6; 14 -3.81,2.6
SOT223 = smd 1.219 x 2.235: 1 -2.311,-3.099; 2 0,-3.099; 3 2.311,-3.099 | smd 3.6 x 2.2: 4 0,3.099
1X06 = drill 1.016 pad 1.88: 1 0,0; 2 2.54,0; 3 5.08,0; 4 7.62,0; 5 10.16,0; 6 12.7,0
1X04 = drill 1.016 pad 1.88: 1 0,0; 2 2.54,0; 3 5.08,0; 4 7.62,0
2X3-NS = drill 1.016 pad 1.88: 1 -2.54,-1.27; 2 -2.54,1.27; 3 0,-1.27; 4 0,1.27; 5 2.54,-1.27; 6 2.54,1.27
SCREWTERMINAL-5MM-3 = drill 1.3 pad 2.413 square: 1 0,0 | drill 1.3 pad 2.413: 2 5,0; 3 10,0
1X02 = drill 1.016 pad 1.88: 1 0,0; 2 2.54,0
1X03 = drill 1.016 pad 1.88: 1 0,0; 2 2.54,0; 3 5.08,0
QS = drill 0.61 long: 1 -2.54,0; 2 2.54,0
AXIAL-0.3 = drill 0.9 pad 1.88 long: P$1 -3.81,0; P$2 3.81,0
AXIAL-0.3' = drill 0.9 pad 1.88: P$1 -3.81,0; P$2 3.81,0
SWITCH_SPDT_PTH_11.6X4.0MM = drill 1.016 pad 1.88: 1 0,2.54; 2 0,0; 3 0,-2.54
TQFP32-08 = smd 1.27 x 0.559: 1 -4.293,2.8; 2 -4.293,2; 3 -4.293,1.2; 4 -4.293,0.4; 5 -4.293,-0.4; 6 -4.293,-1.2; 7 -4.293,-2; 8 -4.293,-2.8; 17 4.293,-2.8; 18 4.293,-2; 19 4.293,-1.2; 20 4.293,-0.4; 21 4.293,0.4; 22 4.293,1.2; 23 4.293,2; 24 4.293,2.8 | smd 0.559 x 1.27: 9 -2.8,-4.293; 10 -2,-4.293; 11 -1.2,-4.293; 12 -0.4,-4.293; 13 0.4,-4.293; 14 1.2,-4.293; 15 2,-4.293; 16 2.8,-4.293; 25 2.8,4.293; 26 2,4.293; 27 1.2,4.293; 28 0.4,4.293; 29 -0.4,4.293; 30 -1.2,4.293; 31 -2,4.293; 32 -2.8,4.293
SO20 = smd 0.6 x 2.2: 1 -5.715,-4.6; 2 -4.445,-4.6; 3 -3.175,-4.6; 4 -1.905,-4.6; 5 -0.635,-4.6; 6 0.635,-4.6; 7 1.905,-4.6; 8 3.175,-4.6; 9 4.445,-4.6; 10 5.715,-4.6; 11 5.715,4.6; 12 4.445,4.6; 13 3.175,4.6; 14 1.905,4.6; 15 0.635,4.6; 16 -0.635,4.6; 17 -1.905,4.6; 18 -3.175,4.6; 19 -4.445,4.6; 20 -5.715,4.6
WIRELESS-BLUETOOTH-HC-05-MIRROR = drill 1 square: 1 6.35,-17.145 | drill 1: 2 3.81,-17.145; 3 1.27,-17.145; 4 -1.27,-17.145; 5 -3.81,-17.145; 6 -6.35,-17.145
3,6 = hole 3.6: 0,0
TRIMPOT-PTH-3386U = drill 1.016 pad 1.88 square: 1 -2.54,-0.015 | drill 1.016 pad 1.88: 2 0,-0.015; 3 2.54,-0.015

### Placement (x,y rotation side)
C1  17.39,42.53 270 top
C2  47.73,5.98 180 top
C3  20.78,45.63 270 top
C4  45.41,3.26 0 top
C5  48.14,17.98 180 top
C6  45.19,11.65 0 top
C7  45.17,9.55 0 top
C8  70.47,26.28 270 top
C9  58.33,23.78 270 top
C10  62.23,9.2 90 top
C11  64.09,5.08 270 top
C14  69.9,41.5 90 top
C15  75,41.7 90 top
CN1  80.2,18.09 270 top
D1  50.06,13.18 0 top
D2  48.47,15.66 0 top
H1H2  96.14,89.89 180 top
IC1  62.24,16.2 180 top
IC4  72.38,50.79 0 top
J1  20.46,86.39 0 top
J2  92.47,13.92 180 top
J3  14.84,85.12 0 top
J4  82.08,5.66 180 top
J5  92.53,37.67 270 top
J6  88.97,37.67 270 top
J7  85.29,37.67 270 top
J8  80.72,37.54 270 top
J9  24.38,13.46 90 top
J10  42.95,69.84 0 top
Q1  17.2,57.14 90 top
R1  41.29,57.71 0 top
R2  87.04,63.98 0 top
R5  86.75,69.56 180 top
R6  10k  [AXIAL-0.3']  92.4,26.24 90 top
R7  10k  [AXIAL-0.3']  88.97,26.37 90 top
R8  10k  [AXIAL-0.3']  85.42,26.49 90 top
R9  63.53,22.95 270 top
R10  61.01,22.95 270 top
R11  60.5,9.21 90 top
R12  64.03,9.2 90 top
R13  1ohm  [AXIAL-0.3']  32.22,23.18 270 top
R14  1ohm  [AXIAL-0.3']  28.21,23.21 270 top
R15  1ohm  [AXIAL-0.3']  24.38,23.21 270 top
R16  1ohm  [AXIAL-0.3']  39.82,23.01 270 top
R17  1ohm  [AXIAL-0.3']  36.11,23.01 270 top
S1  74.09,82.76 0 top
S2  67.96,82.79 180 top
S3  61.48,82.89 0 top
U1  28.4,47.42 0 top
U$1  35.84,8.93 270 top
U$4  86.58,59.3 180 top
U$11  [3,6]  5.21,82.27 0 top
U$12  [3,6]  91.06,84.81 0 top
U$13  [3,6]  91.06,5.05 0 top
U$14  [3,6]  5.21,7.59 0 top
VR1  25.92,77.66 180 top
VR2  71.11,69.19 0 top

### Tracks (layer width: path | path; a pad name or v marks a point on that pad's centre or on a via)
5V0  (via drill 0.7 pad 1.2)
  Top 0.305: v56.2,87.7 49.5,87.7 48.55,88.66 11.25,88.66 10.1,87.5 10.1,80.3 10.9,79.5 13.9,79.5 14.5,78.9 14.5,42.6 14.9,42.2 14.9,42.26 v14.95,42.3
  Bottom 0.2: v14.95,42.3 8.5,42.3 7.74,43.05 H1H2.77
  Bottom 0.305: H1H2.78 H1H2.77 | v56.2,87.7 56.2,80.9 56.8,80.3 61.44,80.3 S3.3
5VDC  (via drill 0.7 pad 1.2)
  Top 0.305: IC4.3 74.69,50.09 74.8,50.2 74.3,50.7 69.5,50.7 68.8,51.4 68.8,56.31 69.44,56.96 69.44,60.55 70.7,61.8 75.9,61.8 76.8,62.7 76.8,79.5 78.1,80.8 v78.1,82.7
  Top 0.813: IC4.3 75.89,47.69 75.9,47.7 77.3,46.3 77.3,40.6 77,40.3 C15.1
  Bottom 0.305: v78.1,82.7 74.15,82.7 | 74.15,82.7 S1.2 | S3.2 59.81,82.89 58.9,83.8 58.9,86.9 59.5,87.5 70.4,87.5 71,86.9 71,83.2 71.5,82.7 74.15,82.7
11V1  (via drill 0.7 pad 1.2, 0.7 pad 2)
  Top 0.305: C14.1 69.7,40.1 69.6,40.2 v62.9,40.2 61.8,41.3 v61.8,75.3 | C2.+ 45.5,6.27 45.5,7.4 46.2,8.1 49.6,8.1 51.4,9.9 51.4,12.68 D1.A 52.2,13.48 v52.2,33.3
  Top 0.61: C2.+ 44.7,5.98 | 44.7,5.98 44.08,5.98 42.59,4.49 U$1.12 U$1.9 | C4.1 44.56,5.84 44.7,5.98
  Top 0.813: IC4.1 68.71,47.69 68.7,47.7 67.3,46.3 67.3,41.2 68.4,40.1 69.7,40.1
  Bottom 0.305: v62.9,40.2 62.8,40.3 58.4,40.3 52.2,34.1 v52.2,33.3 | v61.8,75.3 64.1,75.3 64.7,75.9 64.7,84.6 65.43,85.33 S2.3
+5V  (via drill 0.7 pad 1.2, 0.7 pad 2)
  Top 0.305: IC1.4 62.24,24.84 62.3,24.9 59.7,27.5 59.7,53.6 v58.6,54.7 | 25.7,46.22 26.58,46.22 27.38,45.42 U1.18 37.38,45.42 38,44.8 v38,39.9 | 25.7,46.22 U1.6 | v48.17,37.87 48.5,38.2 52.1,38.2 57,43.1 57,53.1 v58.6,54.7 | v58.7,71.5 58.7,64.3 | 58.7,64.3 v58.6,64.2 | v32.8,66.2 34.7,64.3 58.7,64.3 | R1.2 57.89,57.71 58.5,57.1 58.5,54.8 v58.6,54.7 | U1.4 25.48,47.82 25.7,47.6 25.7,46.22
  Bottom 0.305: J1.4 28.08,84.62 29,83.7 34.1,83.7 34.7,83.1 34.7,80.6 34,79.9 24.3,79.9 23.38,78.98 VR1.3 23.38,75.02 | 74.09,72.5 S1.3 74.11,80.2 79,80.2 80.3,81.5 86.3,81.5 87.58,80.22 89.48,80.22 90.4,79.3 U$4.5 | 74.09,72.5 74.09,69.62 VR2.3 | v38,39.9 38,41 38.3,41.3 40.9,41.3 44.33,37.87 v48.17,37.87 | 74.09,72.5 59.5,72.5 58.7,71.7 v58.7,71.5 | v58.6,64.2 58.6,54.8 58.7,54.7 v58.6,54.7 | 23.38,75.02 26.1,72.3 32.3,72.3 32.8,71.8 v32.8,66.2 | J3.2 11.21,86.39 11.2,86.4 10.7,85.9 10.7,82.24 12.94,80 15.3,80 16.5,78.8 16.5,72.5 17.1,71.9 17.1,70.5 17.5,70.1 23.1,70.1 23.38,70.38 23.38,75.02
EN1  (via drill 0.7)
  Top 0.305: v20.6,34 20.6,36.1 25.6,41.1 U1.9 | U$1.8 26.16,5.75 25.5,5.1 v24.2,5.1
  Bottom 0.508: v24.2,5.1 22.4,5.1 20.6,6.9 v20.6,34
EN2
  Top 0.305: U$1.3 31.14,12 25.9,12 25.1,11.2 22.9,11.2 21.6,12.5 21.6,29.8 27.2,35.4 U1.11
EN3  (via drill 0.7 pad 2)
  Top 0.305: U$1.13 38.65,5.75 36.9,7.5 36.9,16.9 38,18 v38,32.9 | v38,37 30.1,37 28.8,38.3 U1.13
  Bottom 0.305: v38,32.9 v38,37 38,37.1
GND  (via drill 0.7, 0.7 pad 1.2)
  Top 0.2: C1.1 17.39,46.49 v17.5,46.6 17.9,47 20.81,47
  Top 0.254: U1.5 22.6,47.02 22.58,47 20.81,47 20.79,47.02
  Top 0.305: C2.- 50.37,5.87 | 50.37,5.87 52.01,4.23 C11.2 65.63,4.23 69.9,8.5 69.9,20.6 70.5,21.2 72,21.2 72.7,21.9 72.7,25.43 | IC1.11 62.24,15.04 62.9,15.7 66.4,15.7 67.8,17.1 67.8,24.7 68.53,25.43 C8.2 72.7,25.43 | 72.7,25.43 75.13,25.43 77.1,27.4 77.1,31.9 | 77.1,31.9 77.1,37.7 | 50.37,5.87 52.27,5.87 53.3,6.9 v53.3,9.6 53.3,15 v54.1,15.8 | v49,10.6 47.95,9.55 C7.2 | v64.3,63.1 v72.7,63.1 | v76.7,56.8 73.5,56.8 72.38,55.68 IC4.4 | v17.5,49.5 19.9,52.2 21.3,53.6 21.3,56.6 22.6,57.9 v24.8,57.9 | C9.2 56.47,22.93 55.9,23.5 55.9,32.1 57,33.2 v57.7,33.2 | v68.2,31.9 77.1,31.9 | v49.6,20.1 45.6,20.1 v44.8,19.3 | U1.3 24.09,48.6 23.1,48.6 22.6,48.1 22.6,47.02
  Top 0.406: U$1.20 43.77,17.98 44.9,17.98 C5.2 | U$1.1 29.16,14.64 26.7,17.1 v26.8,17.2
  Top 0.508: v44.8,19.3 44.8,18.08 44.9,17.98
  Top 0.61: 46.3,1.4 43.1,1.4 42.6,1.9 42.6,2.7 42.09,3.21 U$1.11 U$1.10 | 46.3,1.4 49.7,1.4 50.3,2 50.3,5.94 C2.- | C4.2 46.26,1.44 46.3,1.4 | IC1.11 62.24,10.06 C10.2 | 20.79,47.02 C3.1
  Top 0.813: C14.2 72.4,42.9 | 72.4,42.9 74.8,42.9 C15.2 | IC4.2 72.38,42.92 | 72.38,42.92 72.4,42.9 | 72.38,42.92 72.38,38.52 73.2,37.7 77.1,37.7 79.1,39.7 79.1,53.3 78.51,53.89 IC4.4
  Bottom 0.2: H1H2.81 7.74,49.05 8.8,50.1 15,50.1 15.4,49.7 15.4,49.4 | 15.4,49.4 15.4,47 15.8,46.6 v17.5,46.6 | v17.5,49.5 15.5,49.5 15.4,49.4
  Bottom 0.305: v49,10.6 52.3,10.6 v53.3,9.6 | 33.16,85.74 J1.6 | J1.6 J1.5 30.62,87.68 29.7,88.6 18.2,88.6 17.38,87.78 J3.6 | 36.1,80.1 33.68,77.68 VR1.1 | 36.1,80.1 36.1,86.1 35.8,86.4 35.79,86.39 J1.6 | U$4.4 87.85,72.28 R5.P$1 93.84,69.56 94.7,68.7 94.7,57.7 93.8,56.8 v76.7,56.8 75.2,56.8 74.5,57.5 74.5,62.1 73.4,63.2 73.3,63.1 v72.7,63.1 | 42.95,67.85 J10.1 37.94,69.84 37.9,69.8 36.1,71.6 36.1,80.1 | 42.95,67.85 43.4,67.4 64.4,67.4 | 64.4,67.4 67.9,67.4 68.57,68.07 VR2.1 | H1H2.84 H1H2.82 H1H2.81 | v64.3,63.1 64.3,67.3 64.4,67.4 | v24.8,57.9 28.49,54.21 38.8,54.21 42.95,58.36 42.95,67.85 | v57.7,33.2 66.8,33.2 68.2,31.8 v68.2,31.9 | v54.1,15.8 52.7,17.2 51.6,17.2 51,17.8 51,19.6 50.6,20 49.7,20 v49.6,20.1
  Bottom 0.406: v26.8,17.2 28.21,18.61 R14.P$2
  Bottom 0.508: R16.P$2 44,19.2 44.1,19.3 v44.8,19.3
  Bottom 0.61: R16.P$2 R17.P$2 32.4,19.2 R13.P$2 28.24,19.38 R14.P$2 R15.P$2
I2C_SCL  (via drill 0.7 pad 1.2)
  Top 0.254: U1.28 28.8,54.3 29.7,55.2 v29.7,56.1 | v24.8,60.2 23.7,60.2
  Top 0.305: 23.7,60.2 19.6,64.3 v16.7,64.3
  Bottom 0.254: v29.7,56.1 28.3,56.1 24.7,59.7 24.7,60 24.8,60.1 v24.8,60.2 | 13.12,66.52 H1H2.43 13.42,66.52 14.9,68 16.5,68 16.7,67.8 v16.7,64.3
I2C_SDA  (via drill 0.7 pad 1.2)
  Top 0.254: U1.27 29.6,53.3 31,54.7 32.1,54.7 32.6,55.2 v32.6,56.6 | v24.7,62.7 23.5,62.7 20.4,65.8
  Top 0.305: 20.4,65.8 19.5,66.7 v15.7,66.7
  Bottom 0.254: v24.7,62.7 26.5,62.7 27.78,61.42 27.78,59.07 29.67,57.18 32.02,57.18 v32.6,56.6 | H1H2.41 13.98,63.98
  Bottom 0.305: 13.98,63.98 15.7,65.7 v15.7,66.7
I_SENSE  (via drill 0.7 pad 1.2)
  Top 0.508: v55.2,12.5 55.2,7.2 56.5,5.9 64.07,5.9 C11.1
  Top 0.61: R12.1 64.03,5.99 C11.1
  Bottom 0.508: R16.P$1 42.38,26.82 43.05,26.15 43.05,24.01 45.01,22.05 47.1,22.05 47.7,21.45 47.7,13.2 48.4,12.5 v55.2,12.5
  Bottom 0.61: J9.2 22,18.38 22,24.6 24.38,26.98 R15.P$1 R14.P$1 32.2,27.02 R13.P$1 35.93,27 R17.P$1 R16.P$1
IN1
  Top 0.2: U1.2 20.18,49.42 18.66,47.9 16.3,47.9 15.95,47.55 15.95,15.45 24.38,7.03 U$1.7
IN2
  Top 0.305: U$1.4 26.04,10.84 25.4,10.2 22.5,10.2 20.4,12.3 20.4,30.1 26.4,36.1 U1.10
IN3
  Top 0.305: U$1.14 38.88,7.03 38.2,7.7 38.2,15.9 39.2,16.9 40.6,16.9 42.2,18.5 42.2,34.2 41.4,35 29.1,35 28,36.1 U1.12
INT_CURR  (via drill 0.7, 0.7 pad 1.2)
  Top 0.305: IC1.14 66.05,10.85 v67,9.9 | v24.3,53 24.11,52.81 U1.1
  Bottom 0.305: v67,9.9 67,15.2 65.8,16.4 58.9,16.4 56.4,18.9 56.4,26.8 53.8,29.4 29.3,29.4 28.5,30.2 28.5,33.9 29.6,35 33.5,35 36.2,37.7 36.2,51.2 34.5,52.9 24.4,52.9 v24.3,53
MCU-RX  (via drill 0.7 pad 1.2, 0.7 pad 2)
  Top 0.305: U1.30 27.2,69.4 31.1,73.3 31.1,77.6 32.6,79.1 v32.6,81.8 57.5,81.8 58.2,82.5 58.2,86.7 59.3,87.8 84.6,87.8 85.3,87.1 85.3,79.8 85.4,79.7 85.4,79.26 v85.3,79.36
  Bottom 0.305: J1.3 25.54,83.56 26.6,82.5 30.7,82.5 31.4,81.8 v32.6,81.8 | v85.3,79.36 U$4.3
MCU-TX  (via drill 0.7 pad 1.2)
  Top 0.305: U1.31 26.4,55.2 | 26.4,55.2 26.4,74.7 25.7,75.4 22.7,75.4 21.7,76.4 21.7,77.8 v20,79.5 | v76,59.8 72.3,59.8 71.3,58.8 v71.3,58.6 | v24.7,55.1 26.3,55.1 26.4,55.2
  Bottom 0.305: R2.P$2 90.85,62.05 88.6,59.8 v76,59.8 | v20,79.5 21.1,79.5 23,81.4 J1.2 | v71.3,58.6 65.8,53.1 58.2,53.1 55.8,55.5 41.9,55.5 40,53.6 25.6,53.6 24.7,54.5 v24.7,55.1
MISO  (via drill 0.7 pad 1.2)
  Top 0.305: U1.16 31.2,41.3 31.9,40.6 v33.1,40.6 33.2,40.6 | v20.6,68 18.8,69.8 v18.8,71.3
  Bottom 0.305: v33.1,40.6 23.9,40.6 22.2,42.3 22.2,63.1 20.6,64.7 v20.6,68 | J3.1 12.3,81.5 13,80.8 15.8,80.8 17.2,79.4 17.2,72.9 v18.8,71.3
MOSI  (via drill 0.7 pad 1.2)
  Top 0.305: U1.15 30.4,39.4 30.9,38.9 31.7,38.9 v31.8,38.8 | v17.9,68 15.9,70 v15.9,71.4
  Bottom 0.305: v31.8,38.8 22.3,38.8 21.4,39.7 21.4,62.2 17.9,65.7 v17.9,68 | J3.4 14.84,87.91 14.1,88.66 11.86,88.66 10.1,86.9 10.1,86.16 10.09,86.15 10.09,80.21 11.3,79 14.9,79 15.89,78.01 15.89,72.25 15.9,72.24 v15.9,71.4
N  (via drill 0.7 pad 2)
  Top 0.305: IC1.9 59.7,16.5 | 59.7,16.5 IC1.6 | 59.7,16.5 59.8,16.6 64.3,16.6 64.78,17.08 IC1.2 64.78,30.62 61.9,33.5 v61.9,35.1 | v68.2,35 73.6,35 v73.7,34.9
  Bottom 0.305: v61.9,35.1 68.2,35.1 v68.2,35 | v73.7,34.9 80.62,34.9 J8.2
N$1  (via drill 0.7 pad 1.2)
  Top 0.254: U1.7 24.09,45.4 21.7,45.4 20.78,44.48 C3.2
  Top 0.305: C3.2 20.78,41.98 v19.8,41
  Bottom 0.2: 20.7,41.9 20.7,59.4 20.4,59.7 20.38,59.68 Q1.2
  Bottom 0.305: v19.8,41 20.7,41.9
N$2  (via drill 0.7 pad 1.2)
  Top 0.254: v17.5,34 17.5,38.4 18.5,39.4 17.39,40.51 C1.2
  Top 0.305: U1.8 24.11,41.01 22.5,39.4 18.5,39.4
  Bottom 0.254: v17.5,34 17.5,41.8 19.5,43.8 19.5,48.5
  Bottom 0.305: Q1.1 19.2,54.6 19.5,54.3 19.5,48.5
N$3
  Bottom 0.305: R2.P$1 82.94,64.26 82.94,69.3 | 82.94,69.3 R5.P$2 | U$4.2 82.77,69.48 82.94,69.3
N$4
  pour Bottom (isolate 0.254): 0.2,-0.1 96.1,-0.1 96.2,0 96.2,89.9 96.1,90 0.1,90 0.1,0.1 0.2,0
N$5
  Top 0.305: U$1.17 40.51,10.9 42.33,10.9 43.08,11.65 C6.1
N$6
  Top 0.305: C6.2 46.3,11.9 46.3,12.8 46.68,13.18 D1.C 48.21,15.11 48.76,15.66 D2.A
N$7
  Top 0.305: U$1.18 42.01,12.11 45.56,15.66 D2.C
  Top 0.406: D2.C 47.57,16.6 48.5,16.6 48.99,17.09 C5.1
N$8  (via drill 0.7 pad 1.2)
  Top 0.305: v70.5,22.8 69.5,22.8 68.8,22.1 68.8,16.8 68.8,16.6 68.8,8.8 67.5,7.5 65.9,7.5 65.4,8 65.4,11.3 64.78,11.92 IC1.13
  Bottom 0.305: v70.5,22.8 71.5,22.8 71.9,23.2 71.9,36.4 73.4,37.9 73.4,59.3 71.11,61.59 VR2.2
N$9  (via drill 0.7 pad 1.2)
  Top 0.305: v36.8,55.3 36.8,49.9 36.32,49.42 U1.23
  Bottom 0.305: VR1.2 25.92,74.32 25.9,74.3 26.5,73.7 33.7,73.7 35.2,72.2 35.2,55.8 35.7,55.3 v36.8,55.3
N$10
  Top 0.305: U$1.16 44.3,9.56 C7.1
N$11
  Top 0.61: IC1.3 63.51,22.08 R9.2
N$12
  Bottom 0.305: R6.P$2 92.53,30.18 J5.2
N$13
  Bottom 0.305: R7.P$2 J6.2
N$14
  Bottom 0.305: R8.P$2 85.42,35 J7.2
N$15
  Top 0.61: IC1.5 60.97,22.07 R10.2
N$16
  Top 0.61: IC1.10 60.97,11.57 60.5,11.1 R11.2
N$17
  Top 0.61: IC1.12 63.51,11.59 64.03,11.07 R12.2
N$20
  pour Top (isolate 0.254): 0.2,0 96.1,0 96.2,-0.1 96.2,89.8 0.1,89.8 -0.1,90 -0.1,0
N$21  (via drill 0.7)
  Top 0.406: U$1.19 42.08,13.38 43.9,15.2 v43.9,16.1
  Top 0.61: U$1.2 27.93,13.38 27.9,13.4 v27.8,13.4
  Bottom 0.406: v43.9,16.1 28.4,16.1 27.75,15.45 27.75,13.46
  Bottom 0.61: J9.1 27.75,13.46 v27.8,13.4
NF
  Bottom 0.305: J5.1 J6.1 J7.1 80.84,37.67 J8.1
NR  (via drill 0.7)
  Top 0.254: CN1.4 83.46,17.34 84.8,16 84.8,13.96
  Top 0.305: 84.8,13.96 J2.4 | CN1.4 81.19,15.9 v81.4,15.9
  Bottom 0.305: v81.4,15.9 80.72,16.58 J8.3
OUT1  (via drill 0.7, 0.7 pad 1.2, 0.7 pad 2)
  Top 0.254: v91.78,16.68 91.78,17.82 90.76,18.84 CN1.1
  Top 0.305: J2.1 92.5,13.95 92.5,15.97 v91.78,16.68 | U$1.6 33.4,8.29 34.7,9.6 34.7,17 34.1,17.6 34.1,30.9 34.2,33 v33.9,32.9 | v62.1,28.9 63.53,27.47 R9.1 | v68.2,29 70.2,29 70.5,28.7 70.47,28.67 C8.1
  Top 0.813: J4.1 85.72,9.3 87.85,9.3 J2.1
  Bottom 0.305: 91.87,16.6 v91.78,16.68 92.47,17.37 92.47,22.36 R6.P$1 93.17,22.43 94.8,20.8 94.8,12 93.6,10.8 75.6,10.8 74.1,12.3 74.1,19.1 72.2,21 69.3,21 68.2,22.1 v68.2,29 68.1,28.9 v62.1,28.9 62.1,29.7 60.7,31.1 35.7,31.1 v33.9,32.9
  Bottom 0.508: 93.29,22.36 92.47,22.36
OUT2  (via drill 0.7, 0.7 pad 1.2, 0.7 pad 2)
  Top 0.254: v89.4,16.7 89.4,17.8 88.86,18.34 CN1.2 75.54,18.34 74.8,17.6 v72.4,17.6
  Top 0.305: v89.4,16.7 89.9,16.2 89.9,13.94 J2.2 | U$1.5 33.07,9.56 33.7,10.2 33.6,10.3 33.6,15.7 32.6,16.7 31.2,16.7 30.3,17.6 30.3,30.9 v30.1,31.1 | v57.7,28.8 58.33,28.17 C9.1
  Top 0.61: R10.1 60.18,24.63 C9.1
  Top 0.813: J4.2 81.92,10.5 87.2,10.5 89.93,13.23 J2.2
  Bottom 0.203: 57.7,19.6 v57.7,28.8
  Bottom 0.305: v89.4,16.7 89.2,16.9 89.2,17 88.97,17.23 R7.P$1 88.97,24.53 88.6,24.9 | 57.6,28.7 v57.7,28.8 56.1,30.4 30.8,30.4 v30.1,31.1 | v72.4,17.6 59.7,17.6 57.7,19.6
OUT3  (via drill 0.7, 0.7 pad 1.2)
  Top 0.254: CN1.3 86.46,17.84 87.25,17.05 v87.25,16.75
  Top 0.305: v87.25,16.75 87.4,16.6 87.39,16.59 J2.3 | R11.1 59.14,8.36 v57.5,10
  Top 0.508: v66.1,2.1 68.52,2.1 J4.3
  Top 0.61: R11.1 C10.1 | U$1.15 42.3,8.29 42.8,7.8 42.9,7.8 v43,7.7
  Top 0.813: J4.3 78.12,11.7 86.7,11.7 87.39,12.39 J2.3
  Bottom 0.305: R8.P$1 85.42,18.58 v87.25,16.75 87.3,16.7 | v57.5,10 57.5,7.7
  Bottom 0.508: 57.5,7.7 57.5,3.3 58.7,2.1 v66.1,2.1
  Bottom 0.61: v43,7.7 57.5,7.7
RESET  (via drill 0.7 pad 1.2)
  Top 0.254: 28,55.1 28,56.61 27.78,56.83 27.78,63.58 v29,64.8
  Top 0.305: U1.29 28,55.1 | v20,76.5 20,75.5 21.2,74.3 24.7,74.3 25.7,73.3 25.7,66 24.9,65.2 v24.7,65.2 | v29,64.8 30.16,63.65 32.34,63.65 34.29,61.7 v36.9,61.7 | v36.9,57.8 39.8,57.8 R1.1
  Bottom 0.305: J1.1 20.46,82.26 18.9,80.7 18.9,77.1 19.5,76.5 v20,76.5 | v24.7,65.2 28.8,65.2 29,65 v29,64.8 | v36.9,57.8 v36.9,61.7
SCK  (via drill 0.7 pad 1.2)
  Top 0.305: U1.17 32.71,44.6 33.9,44.6 34.8,43.7 v34.8,43.1 | v23.3,68 21.4,69.9 v21.4,71.3
  Bottom 0.305: v34.8,43.1 25.5,43.1 23.3,45.3 v23.3,68 23.3,67.9 | J3.3 14.84,82.66 15.9,81.6 17.4,81.6 18.1,80.9 18.1,74.6 v21.4,71.3
V1N
  Top 0.254: U1.26 30.4,53.1 31.3,54 34,54 35.4,55.4 35.4,59.5 36.1,60.2 36.7,60.2
  Top 0.305: IC1.1 66.05,37.35 65.3,38.1 61.3,38.1 60.7,38.7 60.7,59.8 60.3,60.2 36.7,60.2
V2N  (via drill 0.7 pad 2)
  Top 0.305: IC1.7 56.5,18.8 54.5,20.8 54.5,34.4 52.8,36.1 50.9,36.1 v50.8,36.2 | v41,38.9 41,41.3 38.9,43.4 38.9,45.9 38.58,46.22 U1.19
  Bottom 0.305: v41,38.9 43.7,36.2 v50.8,36.2
V3N  (via drill 0.7 pad 1.2)
  Top 0.305: IC1.8 58.43,15.87 55.5,18.8 v53.9,18.8 | U1.22 39.18,48.62 39.86,47.95 39.86,43.59 42.92,40.52 | 42.92,40.52 43.1,40.34 | v49.6,23.5 49.6,24.01 49.65,24.06 49.65,33.76 42.92,40.48 42.92,40.52
  Bottom 0.305: v53.9,18.8 53.9,19.2 v49.6,23.5
VBATT  (via drill 0.7 pad 1.2, 0.7 pad 2)
  Top 0.2: v29.1,68 29.1,68.9 32.5,72.3 v38,72.3
  Bottom 0.2: H1H2.97 7.74,69.55 8.5,70.3 15.3,70.3 16.2,69.4 28.5,69.4 29.1,68.8 v29.1,68
  Bottom 0.305: H1H2.98 H1H2.97 | 48.03,71.87 48.03,72.53 49.2,73.7 64.7,73.7 65.6,74.6 65.6,81.9 66.49,82.79 S2.2
  Bottom 0.508: J10.3 48.03,71.87 47.6,72.3 v38,72.3

### Text on the board
bNames: Proyecto SUCHAI - ADCS - RW - V1.0